# Altium project DB10004_180Micro.PrjPCB
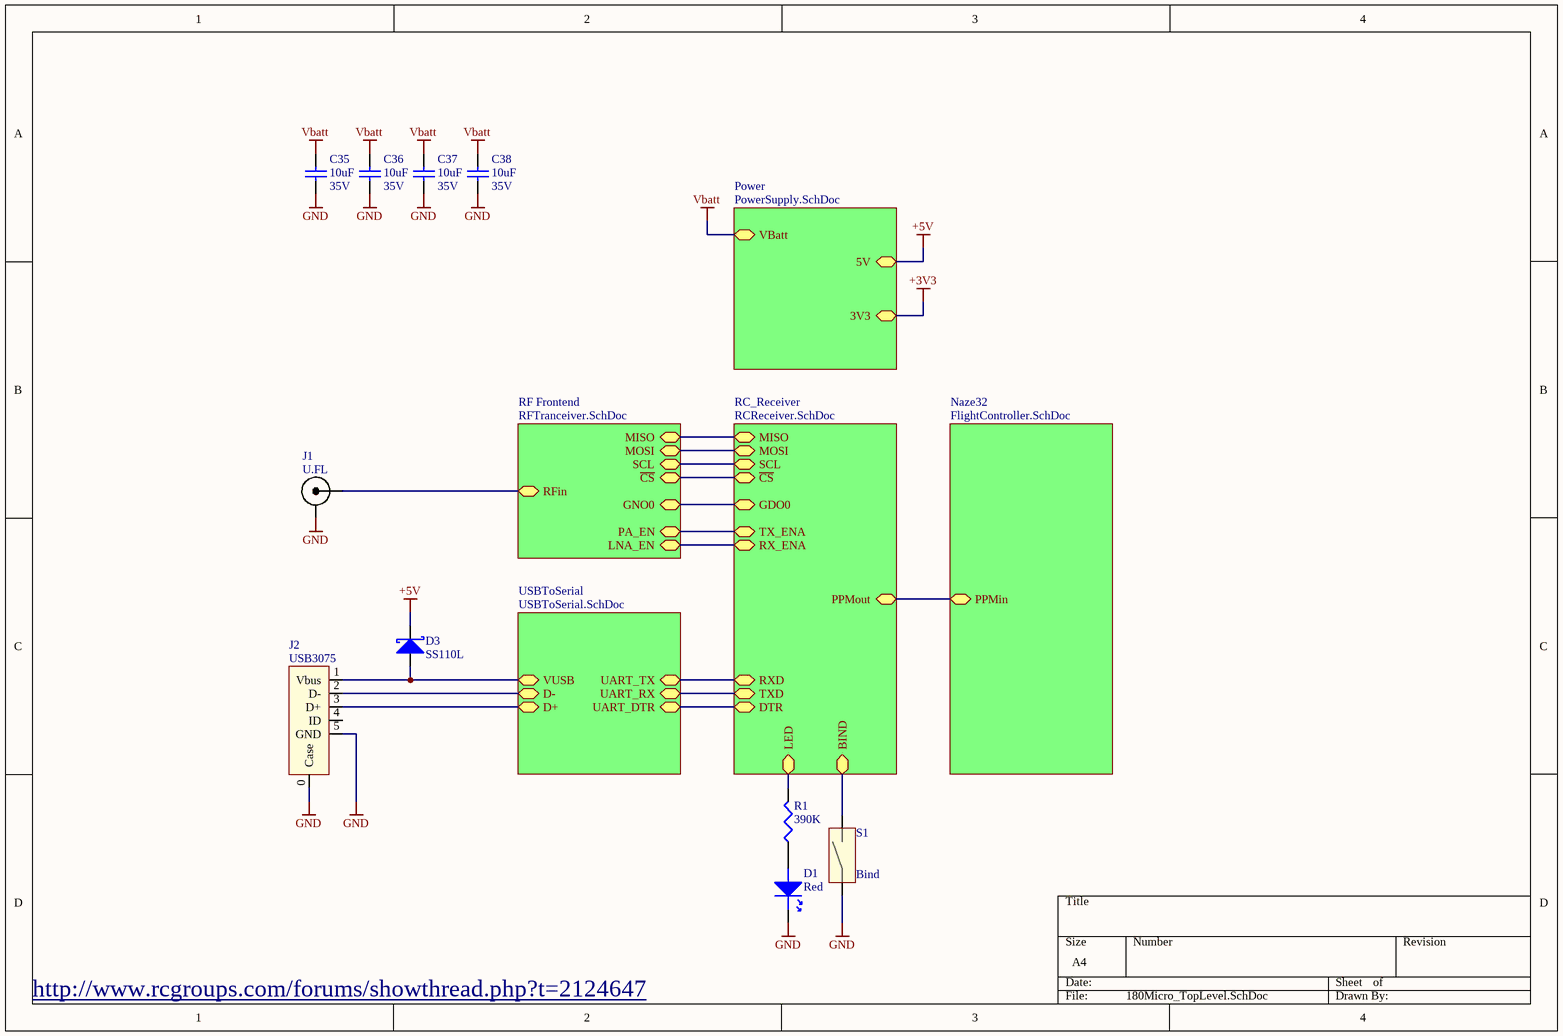
[diagram p0: 180Micro_TopLevel.SchDoc]
6 sheets, 67 parts. Net scope: hierarchical (ports join the sheet entries above them; power ports are global).
Board file: 180Micro_PDB.PcbDoc
Sheets:
  180Micro_TopLevel.SchDoc
    Power = PowerSupply.SchDoc
    RC_Receiver = RCReceiver.SchDoc
    USBToSerial = USBToSerial.SchDoc
    Naze32 = FlightController.SchDoc
    RF Frontend = RFTranceiver.SchDoc

## Sheet 180Micro_TopLevel.SchDoc
size A4

### Parts
C35  10uF  Voltage Rating: 35V
C36  10uF  Voltage Rating: 35V
C37  10uF  Voltage Rating: 35V
C38  10uF  Voltage Rating: 35V
D1  Red  [D-0805]
D3  SS110L  [SUB-SMA]
J1  U.FL  [U_FL]
J2  USB3075  [USB3075]
R1  390K  [0603]
S1  Bind  [KSS]

### Sub-sheets
Naze32 = FlightController.SchDoc: PPMin
Power = PowerSupply.SchDoc: 5V, 3V3, VBatt
RC_Receiver = RCReceiver.SchDoc: PPMout, RXD, TXD, DTR, MISO, MOSI, SCL, ~{CS}, BIND, LED, RX_ENA, TX_ENA, GDO0
RF Frontend = RFTranceiver.SchDoc: RFin, MISO, MOSI, SCL, ~{CS}, PA_EN, LNA_EN, GNO0
USBToSerial = USBToSerial.SchDoc: VUSB, UART_RX, UART_DTR, D-, D+, UART_TX

### Nets
+5V: D3.2(K) ; sheet Power/5V
GND: C35.1 C36.1 C37.1 C38.1 D1.K J1.0(GND) J2.0(Case) J2.5(GND) S1.1
Vbatt: C35.2 C36.2 C37.2 C38.2 ; sheet Power/VBatt
NetBAL1_1: J1.1 ; sheet RF Frontend/RFin
NetC8_2: D3.1(A) J2.1(Vbus) ; sheet USBToSerial/VUSB
NetC30_1: sheet RC_Receiver/DTR, sheet USBToSerial/UART_DTR
NetD1_A: D1.A R1.1
NetD9_K1: J2.2(D-) ; sheet USBToSerial/D-
NetD9_K2: J2.3(D+) ; sheet USBToSerial/D+
NetIC2_1: sheet RC_Receiver/GDO0, sheet RF Frontend/GNO0
NetIC2_2: sheet RC_Receiver/SCL, sheet RF Frontend/SCL
NetIC2_9: sheet RC_Receiver/MOSI, sheet RF Frontend/MOSI
NetIC2_14: sheet RC_Receiver/PPMout, sheet Naze32/PPMin
NetIC2_23: S1.2 ; sheet RC_Receiver/BIND
NetIC2_24: sheet RC_Receiver/RX_ENA, sheet RF Frontend/LNA_EN
NetIC2_25: sheet RC_Receiver/TX_ENA, sheet RF Frontend/PA_EN
NetIC2_26: R1.2 ; sheet RC_Receiver/LED
NetIC2_30: sheet RC_Receiver/RXD, sheet USBToSerial/UART_TX
NetIC2_31: sheet RC_Receiver/TXD, sheet USBToSerial/UART_RX
NetIC2_32: sheet RC_Receiver/~{CS}, sheet RF Frontend/~{CS}
NetIC4_2: sheet RC_Receiver/MISO, sheet RF Frontend/MISO

Not connected (* = marked no-connect by the designer): J2 4(ID)

### Notes on the sheet
- http://www.rcgroups.com/forums/showthread.php?t=2124647

### Library data of the parts
C35-C38 = 10uF/1206/CER/35V: Capacitor, 10uF, 35V, X5R; Dielectric Characteristic: *; Capacitance: 10uF; Capacitance Tolerance: *; Capacitor Case Style: *; Temperature Range: *; Brand Number: *; Brand: *; Price: 0,27; Order Code Supplier: 1797011; Supplier: Farnell
D1 = SML-211UTT86K: Led, Red, Li:2.5mcd, Vf:1.8V, If:0.02A; Brand: ROHM; Case Style: 0805; Forward Current: 0.02A; Forward Voltage: 1.8V; Luminous Intensity: 2.5mcd; Brand Number: SML-211UTT86K; Order Code Supplier: 1685056RL; Price: 0,29; Supplier: Farnell; Temperature Range: -30°C to +85°C
D3 = SS110L: Diode Schottky, Vrrm: 100V, If: 1A, Vf: 0.9V; Brand: TAIWAN SEMICONDUCTOR; Case Style: SMF; Brand Number: SS110L; Forward Current: 1A; Forward Voltage: 0.9V; Order Code Supplier: 1559156; Price: 0,191; Supplier: Farnell; Temperature Range: -55°C to +150°C; Vrrm: 100V
J1 = U.FL-R-SMT: Connector RF Coax; Brand: Hiroze; Brand Number: U.FL-R-SMT(01); Case Style: U_FL; Order Code Supplier: 3908021; Price: 1,53; Supplier: Farnell
J2 = USB3075: USB 2.0 MICRO B, RCPT, 5POS, SMT; Brand: Global Connector Technology; Brand Number: USB3075-30-A; Case Style: Micro B SMT; Pitch: 0.8mm; Order Code Supplier: 2443116; Price: 0,313; Supplier: Farnell
R1 = 390K/0603/0100W/75V: Resistor, 390K, 1%, 0.1W, 75V, 50PPM, 0603; Brand: VISHAY DRALORIC; Brand Number: CRCW0603390KFKEA; Case Style: 0603; Order Code Supplier: 2122692; Power Rating: 0.1W; Price: 0,145; Resistance: 390K; Supplier: Farnell; Temperature Coefficient: ± 50PPM; Temperature Range: -55°C to +125°C; Voltage Rating: 75V
S1 = KSS341G LFS: Switch, Tactile, SPNO, DC:32V, DC:50mA; Brand: C & K COMPONENTS; Brand Number: KSS341G LFS; Price: 0,42; Order Code Supplier: 1201408; Supplier: Farnell

## Sheet PowerSupply.SchDoc
size A4
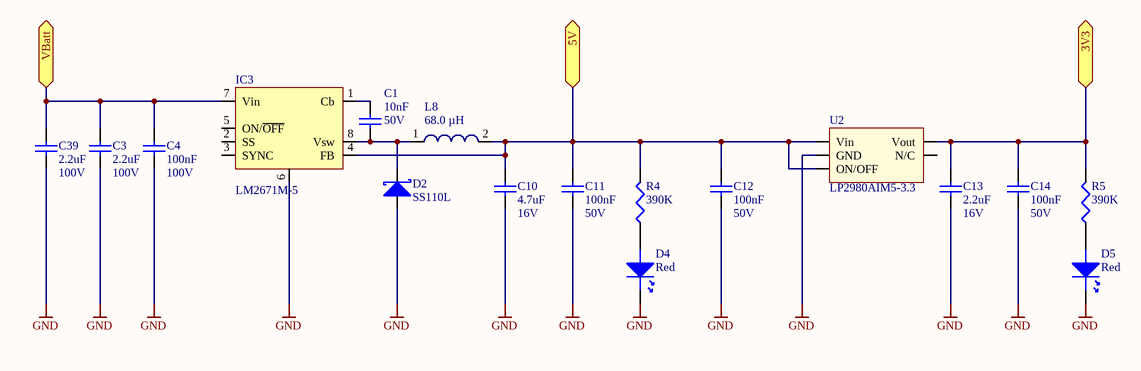
[diagram p1: PowerSupply.SchDoc]

### Parts
C1  10nF  Voltage Rating: 50V  [C0603]
C3  2.2uF  Voltage Rating: 100V  [C-1210]
C4  100nF  Voltage Rating: 100V  [C-1206]
C10  4.7uF  Voltage Rating: 16V  [C-0805]
C11  100nF  Voltage Rating: 50V  [C-0805]
C12  100nF  Voltage Rating: 50V  [C0603]
C13  2.2uF  Voltage Rating: 16V  [C0603]
C14  100nF  Voltage Rating: 50V  [C0603]
C39  2.2uF  Voltage Rating: 100V  [C-1210]
D2  SS110L  [SUB-SMA]
D4  Red  [D-0805]
D5  Red  [D-0805]
IC3  LM2671M-5  [SO-8]
L8  68.0 µH  [WE-LQ M]
R4  390K  [0603]
R5  390K  [0603]
U2  LP2980AIM5-3.3  [TSOT23]

### Ports
3V3, 5V, VBatt

### Nets
+3V3: C13.2 C14.2 R5.2 U2.5(Vout) ; port 3V3
+5V: C10.2 C11.2 C12.2 IC3.4(FB) L8.2 R4.2 U2.1(Vin) U2.3(ON/OFF) ; port 5V
GND: C3.1 C4.1 C10.1 C11.1 C12.1 C13.1 C14.1 C39.1 D2.1(A) D4.K D5.K IC3.6(GND) U2.2(GND)
Vbatt: C3.2 C4.2 C39.2 IC3.7(Vin) ; port VBatt
NetC1_1: C1.1 D2.2(K) IC3.8(Vsw) L8.1
NetC1_2: C1.2 IC3.1(Cb)
NetD4_A: D4.A R4.1
NetD5_A: D5.A R5.1

Not connected (* = marked no-connect by the designer): IC3 2(SS) 3(SYNC) 5(ON/~{OFF}); U2 4(N/C)

### Library data of the parts
C1 = 10nF/0603/CER/50V: Capacitor, 10nF, 50V, X7R; Capacitance Tolerance: ± 10%; Capacitor Case Style: 0603; Brand Number: C0603C103K5RACTU; Brand: KEMET; Dielectric Characteristic: X7R; Capacitance: 10nF; Temperature Range: -55°C to +125°C; Price: 0,011; Order Code Supplier: 1414609; Supplier: Farnell
C3 C39 = 2.2uF/1210/CER/100V: Capacitor, 2.2uF, 100V, X7R; Capacitance Tolerance: ± 20%; Capacitor Case Style: 1210; Brand Number: C1210C225M1RACTU; Brand: KEMET; Dielectric Characteristic: X7R; Capacitance: 2.2uF; Temperature Range: -55°C to +125°C; Price: 0,64; Order Code Supplier: 1838747; Supplier: Farnell
C4 = 100nF/1206/CER/100V: Capacitor, 100nF, 100V, X7R; Capacitance Tolerance: ± 10%; Capacitor Case Style: 1206; Brand Number: C1206C104K1RACTU; Brand: KEMET; Dielectric Characteristic: X7R; Capacitance: 100nF; Temperature Range: -55°C to +125°C; Price: 0,079; Order Code Supplier: 1414714; Supplier: Farnell
C10 = 4.7uF/0805/CER/16V: Capacitor, 4.7uF, 16V, X7R; Capacitance Tolerance: ± 10%; Capacitor Case Style: 0805; Brand Number: GRM21BR71C475KA73L; Brand: MURATA; Dielectric Characteristic: X7R; Capacitance: 4.7uF; Temperature Range: -55°C to +125°C; Price: 0,26; Order Code Supplier: 1797015; Supplier: Farnell
C11 = 100nF/0805/CER/50V: Capacitor, 100nF, 50V,  X7R; Capacitance Tolerance: ± 10%; Capacitor Case Style: 0805; Brand Number: C0805C104K5RACTU; Brand: KEMET; Dielectric Characteristic: X7R; Capacitance: 100nF; Temperature Range: -55°C to +125°C; Price: 0,022; Order Code Supplier: 1414664; Supplier: Farnell
C12 C14 = 100nF/0603/CER/50V: Capacitor, 100nF, 50V, X7R; Capacitance Tolerance: ± 10%; Capacitor Case Style: 0603; Brand Number: MCCA000255; Brand: MULTICOMP; Dielectric Characteristic: X7R; Capacitance: 100nF; Temperature Range: -55°C to +125°C; Price: 0,008; Order Code Supplier: 1759122RL; Supplier: Farnell
C13 = 2.2uF/0603/CER/16V: Capacitor, 2.2uF, 16V, X5R; Capacitance Tolerance: +/- 10%; Capacitor Case Style: 0603; Brand Number: GRM188R61C225KE15D; Brand: MURATA; Dielectric Characteristic: X5R; Capacitance: 2.2uF; Temperature Range: -55°C to 85°C; Price: 0,077; Order Code Supplier: 1735526; Supplier: Farnell
D2 = SS110L: as D3 on sheet 180Micro_TopLevel; Brand Number: SS110L; Forward Current: 1A; Forward Voltage: 0.9V; Order Code Supplier: 1559156; Price: 0,191; Supplier: Farnell; Temperature Range: -55°C to +150°C; Vrrm: 100V
D4 D5 = SML-211UTT86K: as D1 on sheet 180Micro_TopLevel; Brand Number: SML-211UTT86K; Order Code Supplier: 1685056RL; Price: 0,29; Supplier: Farnell; Temperature Range: -30°C to +85°C
IC3 = LM2671M-5: 5V DC/DC Converter; Case Style: SOIC8; Brand Number: LM2671M-5.0/NOPB; Brand: TEXAS INSTRUMENTS; Supplier: Farnell; Price: 3,16; Order Code Supplier: 1469200
L8 = WE-LQ M, 744032680: SMD-RF-Inductor WE-LQ, L=68.0 µH; partNo: 744032680; Inductance: 68.0 µH; ComponentLink1Description: Manufacturer; ComponentLink1URL: http://www.we-online.de; Created by: Christin Zierenner; Created Date: May 2009; ComponentLink2Description: Datasheet; ComponentLink2URL: http://www.we-online.de/katalog/media/pdf/744032680.pdf
R4 R5 = 390K/0603/0100W/75V: as R1 on sheet 180Micro_TopLevel; Case Style: 0603; Order Code Supplier: 2122692; Power Rating: 0.1W; Price: 0,145; Resistance: 390K; Supplier: Farnell; Temperature Coefficient: ± 50PPM; Temperature Range: -55°C to +125°C; Voltage Rating: 75V
U2 = LP2980AIM5-3.3: LDO, Out Voltage: 3.3V/50mA Ultra Low-Dropout Regulator; Brand: National Semiconductor; Case Style: SOT-23; Order Code Supplier: 1212201; Price: 0,38; Brand Number: LP2980AIM5-3.3; Supplier: Farnell; Temperature Range: -40°C to +125°C

## Sheet RCReceiver.SchDoc
size A4
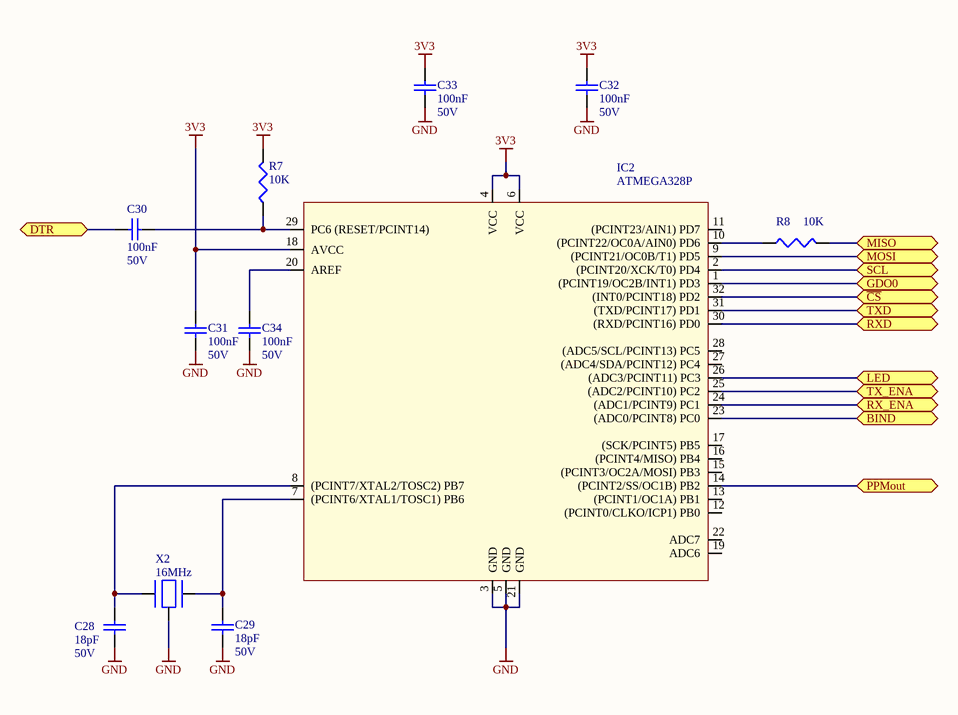
[diagram p2: RCReceiver.SchDoc]

### Parts
C28  18pF  Voltage Rating: 50V  [C0603]
C29  18pF  Voltage Rating: 50V  [C0603]
C30  100nF  Voltage Rating: 50V  [C0603]
C31  100nF  Voltage Rating: 50V  [C0603]
C32  100nF  Voltage Rating: 50V  [C0603]
C33  100nF  Voltage Rating: 50V  [C0603]
C34  100nF  Voltage Rating: 50V  [C0603]
IC2  ATMEGA328P  [LFCSP32]
R7  10K  [0603]
R8  10K  [0603]
X2  16MHz  [7M]

### Ports
BIND, DTR, GDO0, LED, MISO, MOSI, PPMout, RX_ENA, RXD, SCL, TX_ENA, TXD, ~{CS}

### Nets
3V3: C31.2 C32.2 C33.2 IC2.4(VCC) IC2.6(VCC) IC2.18(AVCC) R7.2
GND: C28.1 C29.1 C31.1 C32.1 C33.1 C34.1 IC2.3(GND) IC2.5(GND) IC2.21(GND) X2.0
NetC28_2: C28.2 IC2.8((PCINT7/XTAL2/TOSC2)_PB7) X2.1
NetC29_2: C29.2 IC2.7((PCINT6/XTAL1/TOSC1)_PB6) X2.2
NetC30_1: C30.1 ; port DTR
NetC30_2: C30.2 IC2.29(PC6_(RESET/PCINT14)) R7.1
NetC34_2: C34.2 IC2.20(AREF)
NetIC2_1: IC2.1((PCINT19/OC2B/INT1)_PD3) ; port GDO0
NetIC2_2: IC2.2((PCINT20/XCK/T0)_PD4) ; port SCL
NetIC2_9: IC2.9((PCINT21/OC0B/T1)_PD5) ; port MOSI
NetIC2_10: IC2.10((PCINT22/OC0A/AIN0)_PD6) R8.1
NetIC2_14: IC2.14((PCINT2/SS/OC1B)_PB2) ; port PPMout
NetIC2_23: IC2.23((ADC0/PCINT8)_PC0) ; port BIND
NetIC2_24: IC2.24((ADC1/PCINT9)_PC1) ; port RX_ENA
NetIC2_25: IC2.25((ADC2/PCINT10)_PC2) ; port TX_ENA
NetIC2_26: IC2.26((ADC3/PCINT11)_PC3) ; port LED
NetIC2_30: IC2.30((RXD/PCINT16)_PD0) ; port RXD
NetIC2_31: IC2.31((TXD/PCINT17)_PD1) ; port TXD
NetIC2_32: IC2.32((INT0/PCINT18)_PD2) ; port ~{CS}
NetIC4_2: R8.2 ; port MISO

Not connected (* = marked no-connect by the designer): IC2 11((PCINT23/AIN1)_PD7) 12((PCINT0/CLKO/ICP1)_PB0) 13((PCINT1/OC1A)_PB1) 15((PCINT3/OC2A/MOSI)_PB3) 16((PCINT4/MISO)_PB4) 17((SCK/PCINT5)_PB5) 19(ADC6) 22(ADC7) 27((ADC4/SDA/PCINT12)_PC4) 28((ADC5/SCL/PCINT13)_PC5)

### Library data of the parts
C28 C29 = 18pF/0603/CER/50V: Capacitor, 18pF, 50V, C0G / NP0; Capacitance Tolerance: ± 5%; Capacitor Case Style: 0603; Brand Number: MC0603N180J500CT; Brand: MULTICOMP; Dielectric Characteristic: C0G / NP0; Capacitance: 18pF; Temperature Range: -55°C to +125°C; Price: 0,009; Order Code Supplier: 1759056; Supplier: Farnell
C30-C34 = 100nF/0603/CER/50V: as C12 on sheet PowerSupply; Dielectric Characteristic: X7R; Capacitance: 100nF; Temperature Range: -55°C to +125°C; Price: 0,008; Order Code Supplier: 1759122RL; Supplier: Farnell
IC2 = ATMEGA328P: 8-Bit microcontroller ATMEL
R7 R8 = 10K/0603/0063W/50V: Resistor, 10K, 1%, 0.063W, 50V, 100PPM, 0603; Brand: VISHAY DRALORIC; Brand Number: CRCW060310K0FKEA; Case Style: 0603; Order Code Supplier: 2122493; Power Rating: 0.063W; Price: 0,038; Resistance: 10K; Supplier: Farnell; Temperature Coefficient: ± 100PPM; Temperature Range: -55°C to +125°C; Voltage Rating: 50V
X2 = 7M-16.000MAAJ-T: CRYSTAL, 16MHz,18PF CL, 3.2X2.5MM SMT; Brand: TXC; Order Code Supplier: 1842060; Price: 1,45; Supplier: Farnell; Brand Number: 7M-16.000MAAJ-T

## Sheet USBToSerial.SchDoc
size A4
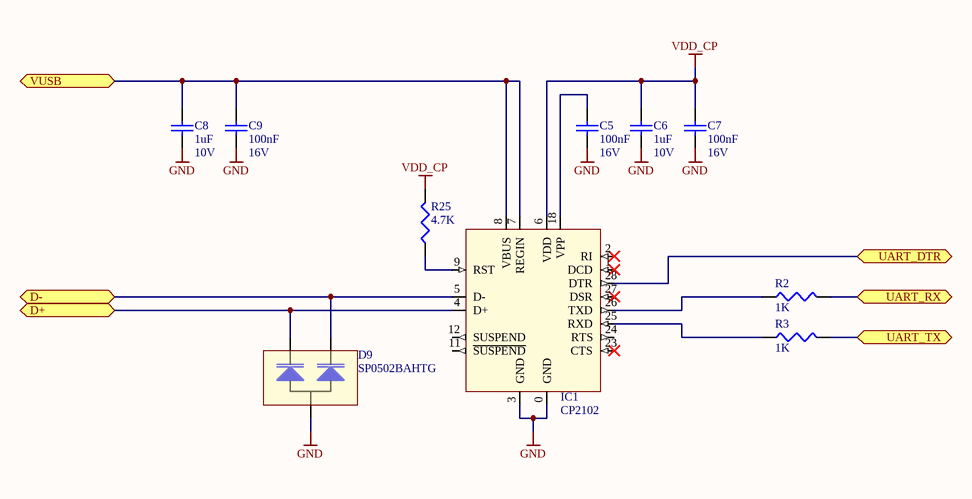
[diagram p3: USBToSerial.SchDoc]

### Parts
C5  100nF  Voltage Rating: 16V  [C0603]
C6  1uF  Voltage Rating: 10V  [C0603]
C7  100nF  Voltage Rating: 16V  [C0603]
C8  1uF  Voltage Rating: 10V  [C0603]
C9  100nF  Voltage Rating: 16V  [C0603]
D9  SP0502BAHTG  [SOT23]
IC1  CP2102  [QFN28]
R2  1K  [0603]
R3  1K  [0603]
R25  4.7K  [0603]

### Ports
D+, D-, UART_DTR, UART_RX, UART_TX, VUSB

### Nets
GND: C5.1 C6.1 C7.1 C8.1 C9.1 D9.A IC1.0(GND) IC1.3(GND)
VDD_CP: C6.2 C7.2 IC1.6(VDD) R25.2
NetC5_2: C5.2 IC1.18(VPP)
NetC8_2: C8.2 C9.2 IC1.7(REGIN) IC1.8(VBUS) ; port VUSB
NetC30_1: IC1.28(DTR) ; port UART_DTR
NetD9_K1: D9.K1 IC1.5(D-) ; port D-
NetD9_K2: D9.K2 IC1.4(D+) ; port D+
NetIC1_9: IC1.9(RST) R25.1
NetIC1_25: IC1.25(RXD) R3.1
NetIC1_26: IC1.26(TXD) R2.1
NetIC2_30: R3.2 ; port UART_TX
NetIC2_31: R2.2 ; port UART_RX

Not connected (* = marked no-connect by the designer): IC1 1(DCD)* 2(RI)* 11(~{SUSPEND}) 12(SUSPEND) 23(CTS)* 24(RTS) 27(DSR)*

### Library data of the parts
C5 C7 C9 = 100nF/0603/CER/16V: Capacitor, 100nF, 16V, X7R; Capacitance Tolerance: ± 10%; Capacitor Case Style: 0603; Brand Number: MC0603B104K160CT; Brand: MULTICOMP; Dielectric Characteristic: X7R; Capacitance: 100nF; Temperature Range: -55°C to +125°C; Price: 0,01; Order Code Supplier: 1759016; Supplier: Farnell
C6 C8 = 1uF/0603/CER/10V/X5R: Capacitor, 1uF, 10V, X5R; Capacitance Tolerance: ± 10%; Brand Number: C1608X5R1A105K080AC; Brand: TDK; Dielectric Characteristic: X5R; Capacitance: 1uF; Capacitor Case Style: C0603; Temperature Range: -55°C to +85°C; Price: 0,0083; Order Code Supplier: 2346890; Supplier: Farnell
D9 = SP0502BAHTG: Diode TVS Dual, Vrwm: 5.5V Vc: 8V; Brand: LITTLEFUSE; Case Style: SOT-23; Brand Number: SP0502BAHTG; Clamping Voltage: 8V; Order Code Supplier: 1827631; Price: 0,80; Supplier: Farnell; Temperature Range: -40°C to +125°C; Vrwm: 5.5V
IC1 = CP2102: USB to UART converter; Brand Number: CP2102-GM; Case Style: QFN28; Price: 3,73; Order Code Supplier: 9282130; Supplier 1: Farnell
R2 R3 = 1K/0603/0063W/50V: Resistor, 1K, 1%, 0.063W, 50V, 100PPM, 0603; Brand: VISHAY DRALORIC; Brand Number: CRCW06031K00FKEA; Case Style: 0603; Order Code Supplier: 2122366; Power Rating: 0.063W; Price: 0,039; Resistance: 1K; Supplier: Farnell; Temperature Coefficient: ± 100PPM; Temperature Range: -55°C to +125°C; Voltage Rating: 50V
R25 = 4.7K/0603/0063W/50V: Resistor, 4.7K, 1%, 0.063W, 60V, 100PPM, 0603; Brand: VISHAY DRALORIC; Brand Number: CRCW06034K70FKEA; Case Style: 0603; Order Code Supplier: 2122450; Power Rating: 0.063W; Price: 0,038; Resistance: 4.7K; Supplier: Farnell; Temperature Coefficient: ± 100PPM; Temperature Range: -55°C to +125°C; Voltage Rating: 60V

## Sheet FlightController.SchDoc
size A4
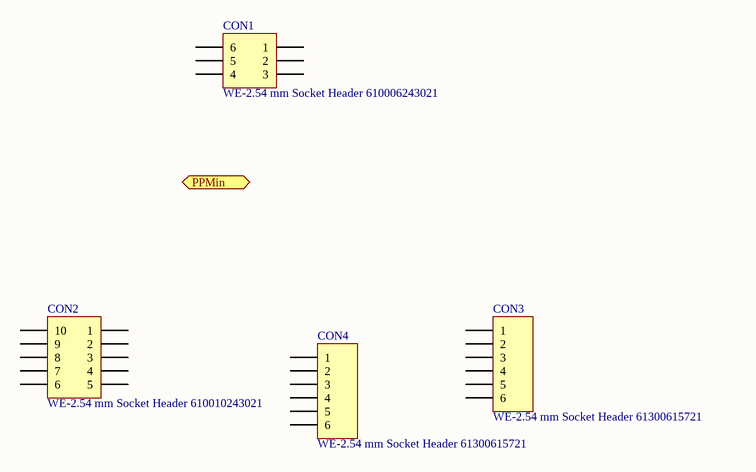
[diagram p4: FlightController.SchDoc]

### Parts
CON1  WE-2.54 mm Socket Header 610006243021  [610006243021]
CON2  WE-2.54 mm Socket Header 610010243021  [610010243021]
CON3  WE-2.54 mm Socket Header 61300615721  [61300615721]
CON4  WE-2.54 mm Socket Header 61300615721  [61300615721]

### Ports
PPMin

### Nets

Not connected (* = marked no-connect by the designer): CON1 1 2 3 4 5 6; CON2 1 2 3 4 5 6 7 8 9 10; CON3 1 2 3 4 5 6; CON4 1 2 3 4 5 6

### Library data of the parts
CON1 = WE-2.54 mm Socket Header 610006243021: WR-PHD 2.54 mm SMT Dual Socket Header Bottom Entry; Manufacturer: W¨¹rth Elektronik eiSos GmbH; ComponentLink1 Description: Manufacturer; ComponentLink2 Description: Datasheet; NoPins: 06; Created Date: 29 March 2013; partNo: 610006243021; ComponentLink1URL: http://www.we-online.com; ComponentLink2URL: http://katalog.we-online.de/em/datasheet/6100xx243021.pdf; Created by: Karrer Zheng
CON2 = WE-2.54 mm Socket Header 610010243021: WR-PHD 2.54 mm SMT Dual Socket Header Bottom Entry; Manufacturer: W¨¹rth Elektronik eiSos GmbH; ComponentLink1 Description: Manufacturer; ComponentLink2 Description: Datasheet; NoPins: 10; Created Date: 29 March 2013; partNo: 610010243021; ComponentLink1URL: http://www.we-online.com; ComponentLink2URL: http://katalog.we-online.de/em/datasheet/6100xx243021.pdf; Created by: Karrer Zheng
CON3 CON4 = WE-2.54 mm Socket Header 61300615721: WR-PHD 2.54 mm Socket Header Bottom Entry; Manufacturer: W¨¹rth Elektronik eiSos GmbH; ComponentLink1 Description: Manufacturer; ComponentLink2 Description: Datasheet; NoPins: 06; Created Date: 1 April 2013; partNo: 61300615721; ComponentLink1URL: http://www.we-online.com; ComponentLink2URL: http://katalog.we-online.de/em/datasheet/6130xx15721.pdf; Created by: Karrer Zheng

## Sheet RFTranceiver.SchDoc
size A4
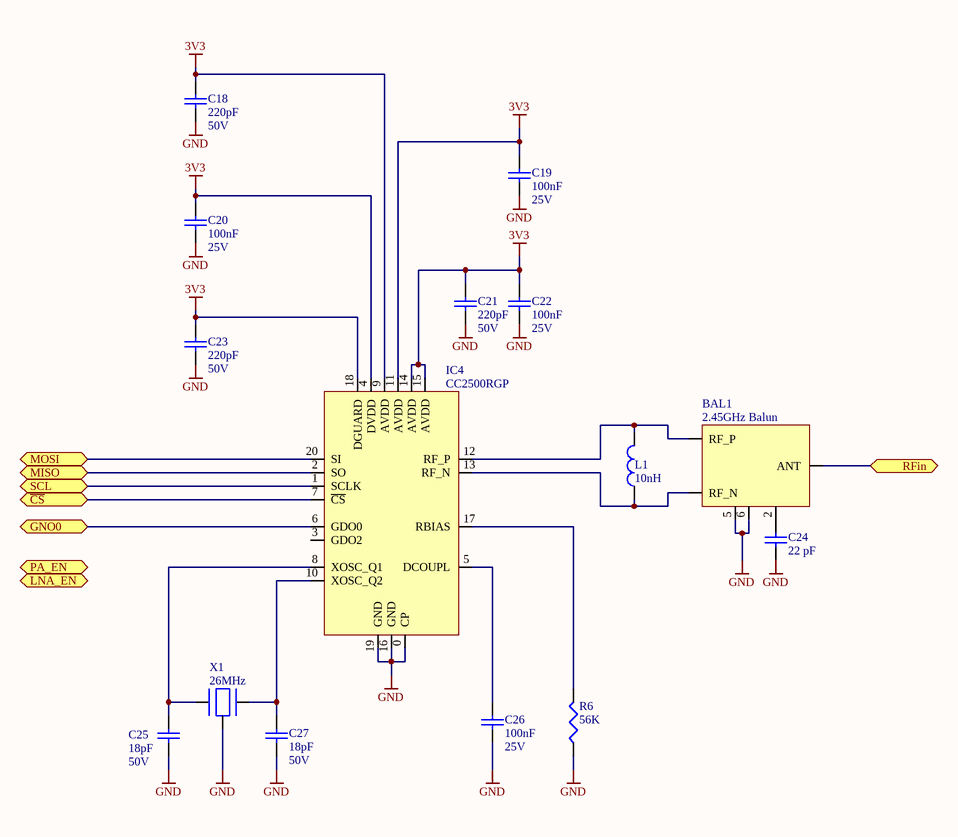
[diagram p5: RFTranceiver.SchDoc]

### Parts
BAL1  2.45GHz Balun  [AgPt]
C18  220pF  Voltage Rating: 50V  [C0402]
C19  100nF  Voltage Rating: 25V  [C0402]
C20  100nF  Voltage Rating: 25V  [C0402]
C21  220pF  Voltage Rating: 50V  [C0402]
C22  100nF  Voltage Rating: 25V  [C0402]
C23  220pF  Voltage Rating: 50V  [C0402]
C24  22 pF  [C0402]
C25  18pF  Voltage Rating: 50V  [C0603]
C26  100nF  Voltage Rating: 25V  [C0402]
C27  18pF  Voltage Rating: 50V  [C0603]
IC4  CC2500RGP  [QFN20]
L1  10nH  [0402]
R6  56K  [0402]
X1  26MHz  [7M]

### Ports
GNO0, LNA_EN, MISO, MOSI, PA_EN, RFin, SCL, ~{CS}

### Nets
3V3: C18.2 C19.2 C20.2 C21.2 C22.2 C23.2 IC4.4(DVDD) IC4.9(AVDD) IC4.11(AVDD) IC4.14(AVDD) IC4.15(AVDD) IC4.18(DGUARD)
GND: BAL1.5(GND) BAL1.6(GND) C18.1 C19.1 C20.1 C21.1 C22.1 C23.1 C24.1 C25.1 C26.1 C27.1 IC4.0(CP) IC4.16(GND) IC4.19(GND) R6.1 X1.0
NetBAL1_1: BAL1.1(ANT) ; port RFin
NetBAL1_2: BAL1.2(GND) C24.2
NetBAL1_3: BAL1.3(RF_N) IC4.13(RF_N) L1.1
NetBAL1_4: BAL1.4(RF_P) IC4.12(RF_P) L1.2
NetC25_2: C25.2 IC4.8(XOSC_Q1) X1.1
NetC26_2: C26.2 IC4.5(DCOUPL)
NetC27_2: C27.2 IC4.10(XOSC_Q2) X1.2
NetIC2_1: IC4.6(GDO0) ; port GNO0
NetIC2_2: IC4.1(SCLK) ; port SCL
NetIC2_9: IC4.20(SI) ; port MOSI
NetIC2_32: IC4.7(~{CS}) ; port ~{CS}
NetIC4_2: IC4.2(SO) ; port MISO
NetIC4_17: IC4.17(RBIAS) R6.2

Not connected (* = marked no-connect by the designer): IC4 3(GDO2)

### Library data of the parts
BAL1 = 2450BM15B0003E: Signal Conditioning 2.45GHz BALUN/FILTER; Brand: JOHANSON TECHNOLOGY; Brand Number: 2450BM15B0003E; Case Style: AgPt; Order Code Supplier: 609-2450BM15B0003E; Price: 1,51; Supplier: Mouser; Temperature Range: -55°C to +155°C
C18 C21 C23 = 220pF/0402/CER/50V: Capacitor, 220pF, 50V, NP0; Capacitance Tolerance: ± 5%; Capacitor Case Style: 0402; Brand Number: GRM1555C1H221JA01D; Brand: MURATA; Dielectric Characteristic: NP0; Capacitance: 220pF; Temperature Range: -55°C to 125°C; Price: 0,02; Order Code Supplier: 8819580; Supplier: Farnell
C19 C20 C22 C26 = 100nF/0402/CER/25V: Capacitor, 100nF, 25V, X7R; Capacitance Tolerance: 10nF; Capacitor Case Style: 0402; Brand Number: GRM155R71E104KE14D; Brand: MULTICOMP; Dielectric Characteristic: X7R; Capacitance: 100nF; Temperature Range: -55 to +125 C; Price: 0,0225; Order Code Supplier: 2456106; Supplier: Farnell
C24 = 22pF/0402/NP0/50V: Capacitor, 22pF, 50V, NP0; Capacitance Tolerance: 0.1 pF; Capacitor Case Style: 0402; Brand Number: 500R07S220GV4T; Brand: JOHANSON TECHNOLOGY; Dielectric Characteristic: NP0; Capacitance: 22 pF; Temperature Range: -55 to +125 C; Price: 0,136; Order Code Supplier: 1885344; Supplier: Farnell; Voltage Rating: 50V
C25 C27 = 18pF/0603/CER/50V: as C28 on sheet RCReceiver; Dielectric Characteristic: C0G / NP0; Capacitance: 18pF; Temperature Range: -55°C to +125°C; Price: 0,009; Order Code Supplier: 1759056; Supplier: Farnell
IC4 = CC2500RGP: RF Transceiver Low-Power 2.4 GHz RF Transceiver; Brand: Texas Instruments; Brand Number: CC2500RGP; Case Style: QFN20; Order Code Supplier: 595-CC2500RGP; Price: 3,65; Supplier: Mouser; Temperature Range: -55°C to +155°C
L1 = 10nH-0403: Inductor, 10nH, 250mAdc, 870ohm; Brand: JohansonTechnologies; Brand Number: L-07C10NJV6T; DC Current: 250mA; Q Self resonance: 21GHz; DC Resistance: 870mOhm; Case Style: 0402; Order Code Supplier: 609-L-07C10NJV6T; Price: 0,101; Supplier: Mouser; Temperature Range: *; Inductance: 10nH
R6 = 56k/0402/0063W/50V: Resistor, 56k, 0.1%, 0.0625W, 50V, 100PPM, 0402; Brand: TE Connectivity; Brand Number: CRG0402F56K; Power Rating: 0.063W; Case Style: 0402; Order Code Supplier: 2331545; Price: 0,0075; Resistance: 56K; Supplier: Farnell; Temperature Coefficient: ± 100PPM; Temperature Range: -55°C to +125°C; Voltage Rating: 50V
X1 = 7M-26.000MAAJ-T: CRYSTAL, 26MHz,18PF CL, 3.2X2.5MM SMT; Brand: TXC; Price: 1,04; Supplier: Farnell; Order Code Supplier: 1842069; Brand Number: 7M-26.000MAAJ-T

## Nets that join several sheets
3V3: RCReceiver (7 pins), RFTranceiver (12 pins)
+5V: 180Micro_TopLevel (D3.2), PowerSupply (8 pins)
GND: 180Micro_TopLevel (9 pins), PowerSupply (13 pins), RCReceiver (10 pins), USBToSerial (8 pins), RFTranceiver (17 pins)
Vbatt: 180Micro_TopLevel (C35.2 C36.2 C37.2 C38.2), PowerSupply (C3.2 C4.2 C39.2 IC3.7)
NetBAL1_1: 180Micro_TopLevel (J1.1), RFTranceiver (BAL1.1)
NetC8_2: 180Micro_TopLevel (D3.1 J2.1), USBToSerial (C8.2 C9.2 IC1.7 IC1.8)
NetC30_1: RCReceiver (C30.1), USBToSerial (IC1.28)
NetD9_K1: 180Micro_TopLevel (J2.2), USBToSerial (D9.K1 IC1.5)
NetD9_K2: 180Micro_TopLevel (J2.3), USBToSerial (D9.K2 IC1.4)
NetIC2_1: RCReceiver (IC2.1), RFTranceiver (IC4.6)
NetIC2_2: RCReceiver (IC2.2), RFTranceiver (IC4.1)
NetIC2_9: RCReceiver (IC2.9), RFTranceiver (IC4.20)
NetIC2_23: 180Micro_TopLevel (S1.2), RCReceiver (IC2.23)
NetIC2_26: 180Micro_TopLevel (R1.2), RCReceiver (IC2.26)
NetIC2_30: RCReceiver (IC2.30), USBToSerial (R3.2)
NetIC2_31: RCReceiver (IC2.31), USBToSerial (R2.2)
NetIC2_32: RCReceiver (IC2.32), RFTranceiver (IC4.7)
NetIC4_2: RCReceiver (R8.2), RFTranceiver (IC4.2)